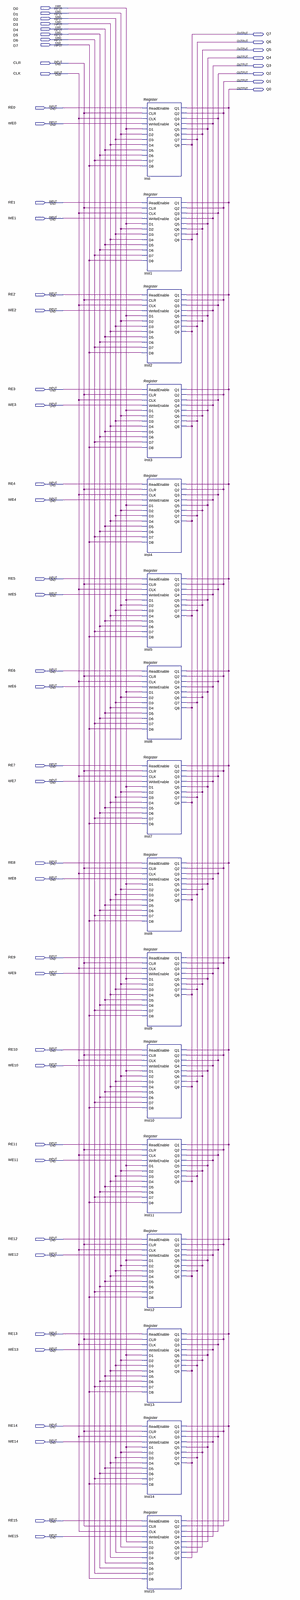
[diagram p0: schematic sheet, whole]
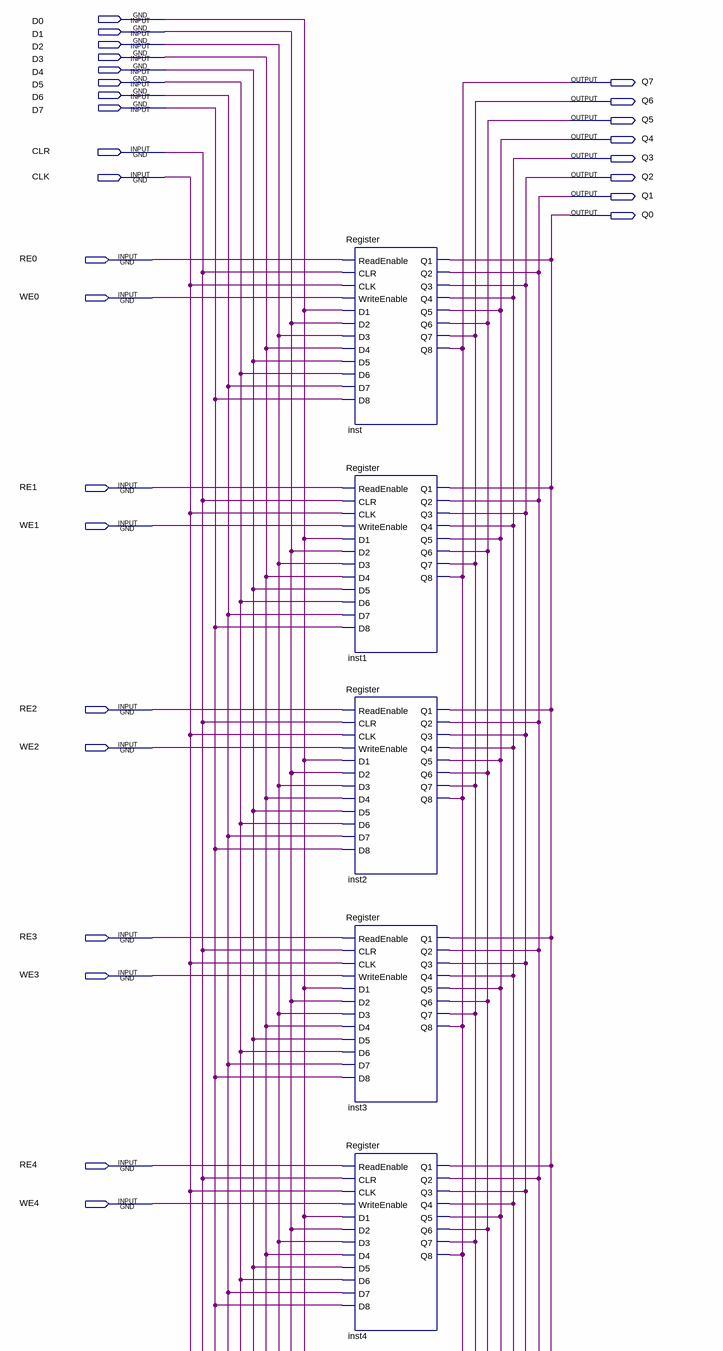
[diagram p1: schematic sheet, upper part]
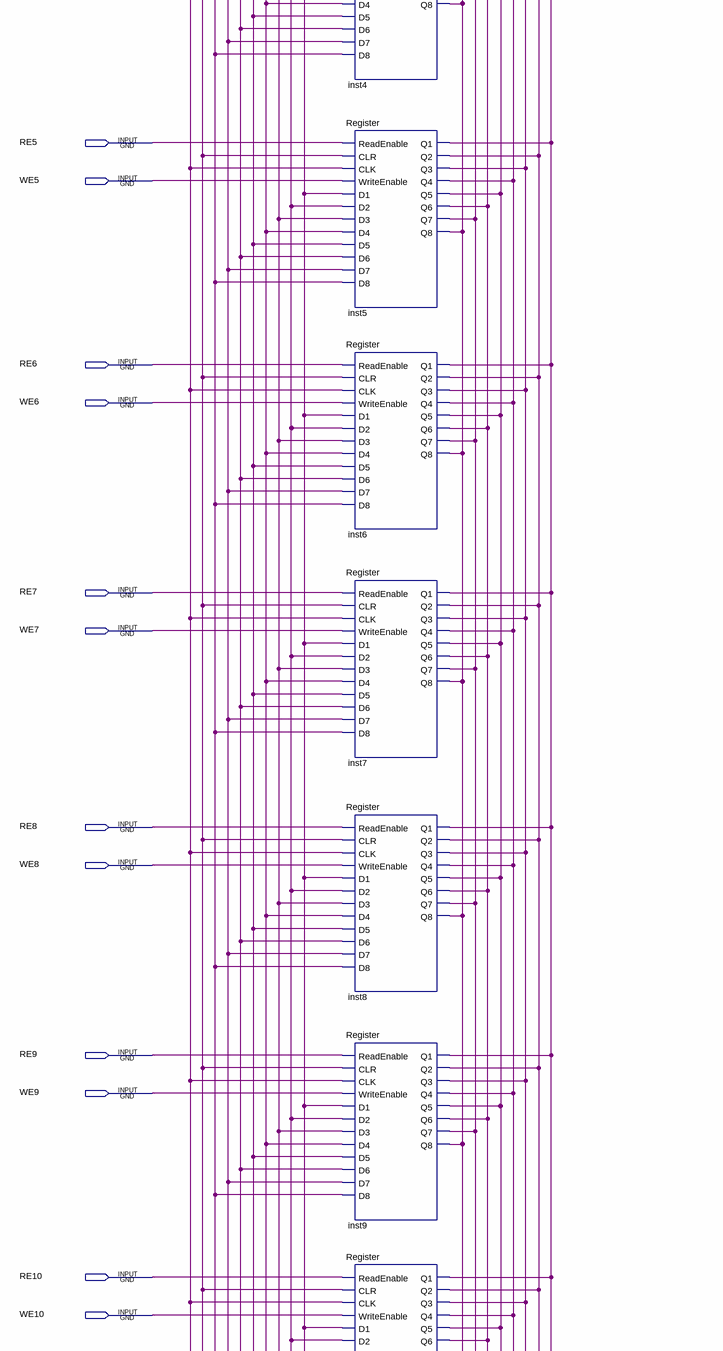
[diagram p2: schematic sheet, middle part]
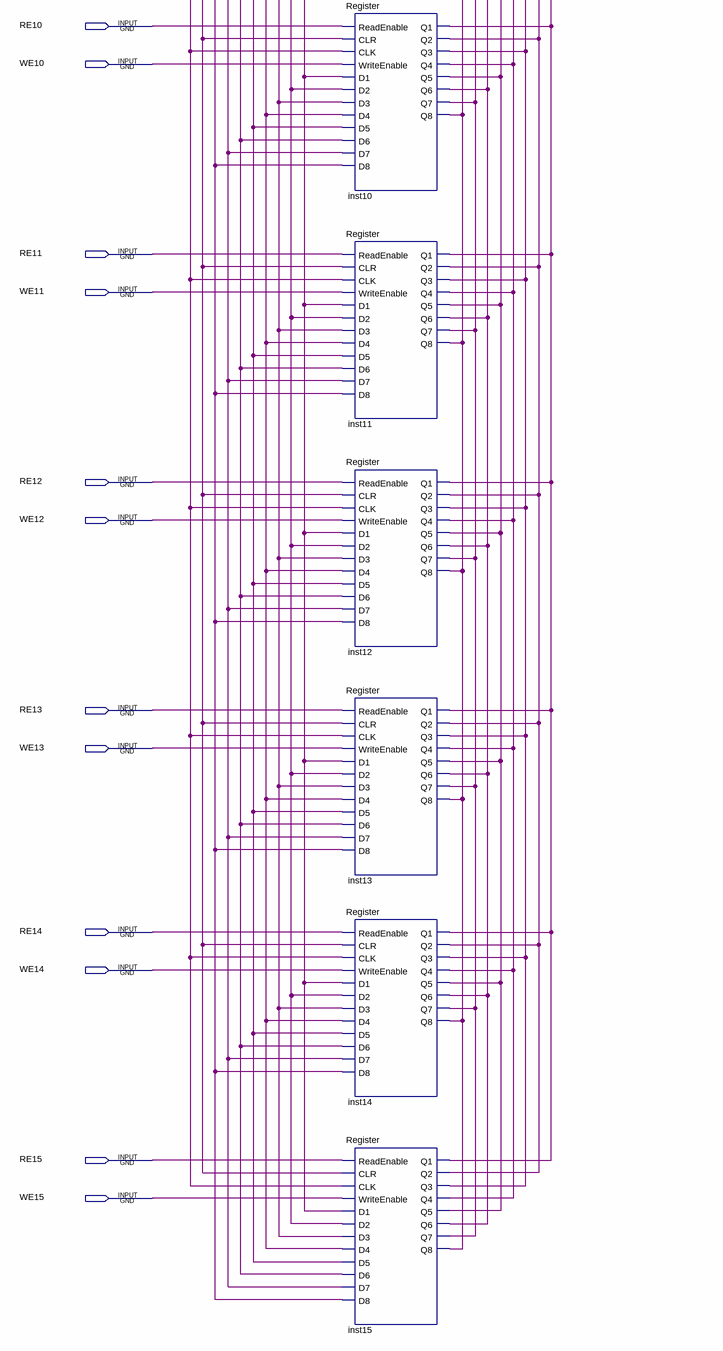
[diagram p3: schematic sheet, lower part]
// Quartus schematic RAM_Cells.bdf as structural Verilog: 16 symbols, 50 pins
module RAM_Cells (
  input  D0,
  input  D1,
  input  D2,
  input  D3,
  input  D4,
  input  D5,
  input  D6,
  input  D7,
  input  CLR,
  input  CLK,
  input  RE0,
  input  WE0,
  input  RE1,
  input  WE1,
  input  RE2,
  input  WE2,
  input  RE3,
  input  WE3,
  input  RE4,
  input  WE4,
  input  RE5,
  input  WE5,
  input  RE6,
  input  WE6,
  input  RE7,
  input  WE7,
  input  RE8,
  input  WE8,
  input  RE9,
  input  WE9,
  input  RE10,
  input  WE10,
  input  RE11,
  input  WE11,
  input  RE12,
  input  WE12,
  input  RE13,
  input  WE13,
  input  RE14,
  input  WE14,
  input  RE15,
  input  WE15,
  output Q7,
  output Q6,
  output Q5,
  output Q4,
  output Q3,
  output Q2,
  output Q1,
  output Q0
);

  Register inst (
    .ReadEnable(RE0), .CLR(CLR), .CLK(CLK), .WriteEnable(WE0), .D1(D0), .D2(D1), .D3(D2), .D4(D3), .D5(D4),
    .D6(D5), .D7(D6), .D8(D7), .Q1(Q0), .Q2(Q1), .Q3(Q2), .Q4(Q3), .Q5(Q4), .Q6(Q5), .Q7(Q6), .Q8(Q7));
  Register inst1 (
    .ReadEnable(RE1), .CLR(CLR), .CLK(CLK), .WriteEnable(WE1), .D1(D0), .D2(D1), .D3(D2), .D4(D3), .D5(D4),
    .D6(D5), .D7(D6), .D8(D7), .Q1(Q0), .Q2(Q1), .Q3(Q2), .Q4(Q3), .Q5(Q4), .Q6(Q5), .Q7(Q6), .Q8(Q7));
  Register inst2 (
    .ReadEnable(RE2), .CLR(CLR), .CLK(CLK), .WriteEnable(WE2), .D1(D0), .D2(D1), .D3(D2), .D4(D3), .D5(D4),
    .D6(D5), .D7(D6), .D8(D7), .Q1(Q0), .Q2(Q1), .Q3(Q2), .Q4(Q3), .Q5(Q4), .Q6(Q5), .Q7(Q6), .Q8(Q7));
  Register inst3 (
    .ReadEnable(RE3), .CLR(CLR), .CLK(CLK), .WriteEnable(WE3), .D1(D0), .D2(D1), .D3(D2), .D4(D3), .D5(D4),
    .D6(D5), .D7(D6), .D8(D7), .Q1(Q0), .Q2(Q1), .Q3(Q2), .Q4(Q3), .Q5(Q4), .Q6(Q5), .Q7(Q6), .Q8(Q7));
  Register inst4 (
    .ReadEnable(RE4), .CLR(CLR), .CLK(CLK), .WriteEnable(WE4), .D1(D0), .D2(D1), .D3(D2), .D4(D3), .D5(D4),
    .D6(D5), .D7(D6), .D8(D7), .Q1(Q0), .Q2(Q1), .Q3(Q2), .Q4(Q3), .Q5(Q4), .Q6(Q5), .Q7(Q6), .Q8(Q7));
  Register inst5 (
    .ReadEnable(RE5), .CLR(CLR), .CLK(CLK), .WriteEnable(WE5), .D1(D0), .D2(D1), .D3(D2), .D4(D3), .D5(D4),
    .D6(D5), .D7(D6), .D8(D7), .Q1(Q0), .Q2(Q1), .Q3(Q2), .Q4(Q3), .Q5(Q4), .Q6(Q5), .Q7(Q6), .Q8(Q7));
  Register inst6 (
    .ReadEnable(RE6), .CLR(CLR), .CLK(CLK), .WriteEnable(WE6), .D1(D0), .D2(D1), .D3(D2), .D4(D3), .D5(D4),
    .D6(D5), .D7(D6), .D8(D7), .Q1(Q0), .Q2(Q1), .Q3(Q2), .Q4(Q3), .Q5(Q4), .Q6(Q5), .Q7(Q6), .Q8(Q7));
  Register inst7 (
    .ReadEnable(RE7), .CLR(CLR), .CLK(CLK), .WriteEnable(WE7), .D1(D0), .D2(D1), .D3(D2), .D4(D3), .D5(D4),
    .D6(D5), .D7(D6), .D8(D7), .Q1(Q0), .Q2(Q1), .Q3(Q2), .Q4(Q3), .Q5(Q4), .Q6(Q5), .Q7(Q6), .Q8(Q7));
  Register inst8 (
    .ReadEnable(RE8), .CLR(CLR), .CLK(CLK), .WriteEnable(WE8), .D1(D0), .D2(D1), .D3(D2), .D4(D3), .D5(D4),
    .D6(D5), .D7(D6), .D8(D7), .Q1(Q0), .Q2(Q1), .Q3(Q2), .Q4(Q3), .Q5(Q4), .Q6(Q5), .Q7(Q6), .Q8(Q7));
  Register inst9 (
    .ReadEnable(RE9), .CLR(CLR), .CLK(CLK), .WriteEnable(WE9), .D1(D0), .D2(D1), .D3(D2), .D4(D3), .D5(D4),
    .D6(D5), .D7(D6), .D8(D7), .Q1(Q0), .Q2(Q1), .Q3(Q2), .Q4(Q3), .Q5(Q4), .Q6(Q5), .Q7(Q6), .Q8(Q7));
  Register inst10 (
    .ReadEnable(RE10), .CLR(CLR), .CLK(CLK), .WriteEnable(WE10), .D1(D0), .D2(D1), .D3(D2), .D4(D3), .D5(D4),
    .D6(D5), .D7(D6), .D8(D7), .Q1(Q0), .Q2(Q1), .Q3(Q2), .Q4(Q3), .Q5(Q4), .Q6(Q5), .Q7(Q6), .Q8(Q7));
  Register inst11 (
    .ReadEnable(RE11), .CLR(CLR), .CLK(CLK), .WriteEnable(WE11), .D1(D0), .D2(D1), .D3(D2), .D4(D3), .D5(D4),
    .D6(D5), .D7(D6), .D8(D7), .Q1(Q0), .Q2(Q1), .Q3(Q2), .Q4(Q3), .Q5(Q4), .Q6(Q5), .Q7(Q6), .Q8(Q7));
  Register inst12 (
    .ReadEnable(RE12), .CLR(CLR), .CLK(CLK), .WriteEnable(WE12), .D1(D0), .D2(D1), .D3(D2), .D4(D3), .D5(D4),
    .D6(D5), .D7(D6), .D8(D7), .Q1(Q0), .Q2(Q1), .Q3(Q2), .Q4(Q3), .Q5(Q4), .Q6(Q5), .Q7(Q6), .Q8(Q7));
  Register inst13 (
    .ReadEnable(RE13), .CLR(CLR), .CLK(CLK), .WriteEnable(WE13), .D1(D0), .D2(D1), .D3(D2), .D4(D3), .D5(D4),
    .D6(D5), .D7(D6), .D8(D7), .Q1(Q0), .Q2(Q1), .Q3(Q2), .Q4(Q3), .Q5(Q4), .Q6(Q5), .Q7(Q6), .Q8(Q7));
  Register inst14 (
    .ReadEnable(RE14), .CLR(CLR), .CLK(CLK), .WriteEnable(WE14), .D1(D0), .D2(D1), .D3(D2), .D4(D3), .D5(D4),
    .D6(D5), .D7(D6), .D8(D7), .Q1(Q0), .Q2(Q1), .Q3(Q2), .Q4(Q3), .Q5(Q4), .Q6(Q5), .Q7(Q6), .Q8(Q7));
  Register inst15 (
    .ReadEnable(RE15), .CLR(CLR), .CLK(CLK), .WriteEnable(WE15), .D1(D0), .D2(D1), .D3(D2), .D4(D3), .D5(D4),
    .D6(D5), .D7(D6), .D8(D7), .Q1(Q0), .Q2(Q1), .Q3(Q2), .Q4(Q3), .Q5(Q4), .Q6(Q5), .Q7(Q6), .Q8(Q7));
endmodule
